# Altium schematic sheet 00_top.SchDoc: KART : Top
size A4; DrawnBy: JNieto; DocumentNumber: 1; Revision: 1.0; SheetNumber: 1; SheetTotal: 10; Version: V 1.0.0
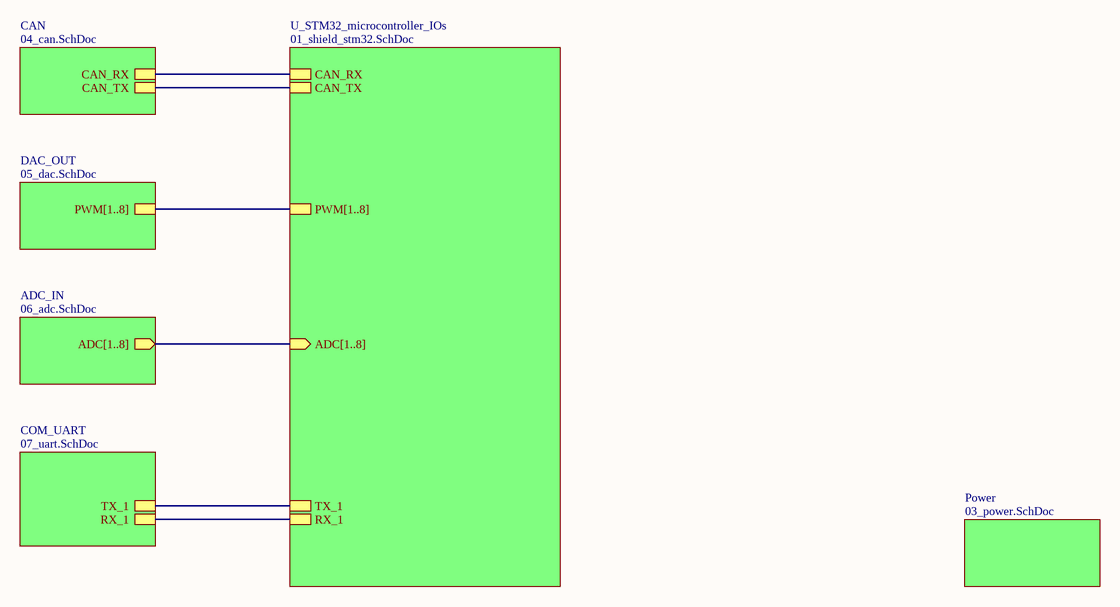
[diagram p0: 00_top.SchDoc]

## Sub-sheets
ADC_IN = 06_adc.SchDoc: ADC[1..8] (out)
CAN = 04_can.SchDoc: CAN_RX, CAN_TX
COM_UART = 07_uart.SchDoc: TX_1, RX_1
DAC_OUT = 05_dac.SchDoc: PWM[1..8]
Power = 03_power.SchDoc: no entries
U_STM32_microcontroller_IOs = 01_shield_stm32.SchDoc: CAN_RX, CAN_TX, PWM[1..8], ADC[1..8] (in), TX_1, RX_1

## Nets
(unnamed): sheet U_STM32_microcontroller_IOs/CAN_RX, sheet CAN/CAN_RX
(unnamed): sheet U_STM32_microcontroller_IOs/CAN_TX, sheet CAN/CAN_TX
(unnamed): sheet U_STM32_microcontroller_IOs/TX_1, sheet COM_UART/TX_1
(unnamed): sheet U_STM32_microcontroller_IOs/RX_1, sheet COM_UART/RX_1

## Buses and harness runs
bus sheet ADC_IN/ADC[1..8] = sheet U_STM32_microcontroller_IOs/ADC[1..8]
bus sheet DAC_OUT/PWM[1..8] = sheet U_STM32_microcontroller_IOs/PWM[1..8]